# Altium schematic sheet BSR049A.SchDoc: LM5146 BUCK SCHEMATIC DIAGRAM
size 431 x 279 mm; Date: Not shown in title block; ApprovedBy: Not shown in title block; CheckedBy: Not shown in title block; Author: Not shown in title block; CompanyName: Not shown in title block; DrawnBy: K Nielson; Engineer: Not shown in title block; Organization: Not shown in title block; Address1: Not shown in title block; Address2: Not shown in title block; Address3: Not shown in title block; Address4: Not shown in title block; DocumentNumber: 1; Revision: Use project parameter SCH_Rev; SheetNumber: 1; SheetTotal: 2; PageSetup: Record=PageOptions|CenterHorizontal=True|CenterVertical=True|PrintScale=0.96|XCorrection=1.00|YCorrection=1.00|PrintKind=0|BorderSize=5000000|LeftOffset=0|BottomOffset=0|Orientation=2|PaperLength=1000|PaperWidth=1000|Scale=100|PaperSource=15|PrintQuality=-3|MediaType=1|DitherType=10|PrintScaleMode=1|PaperKind=11x17|PaperIndex=17; CurrentTime: Not shown in title block; CurrentDate: Not shown in title block; Time: Not shown in title block; DocumentFullPathAndName: Not shown in title block; DocumentName: Not shown in title block; ModifiedDate: Not shown in title block; ImagePath: Not shown in title block
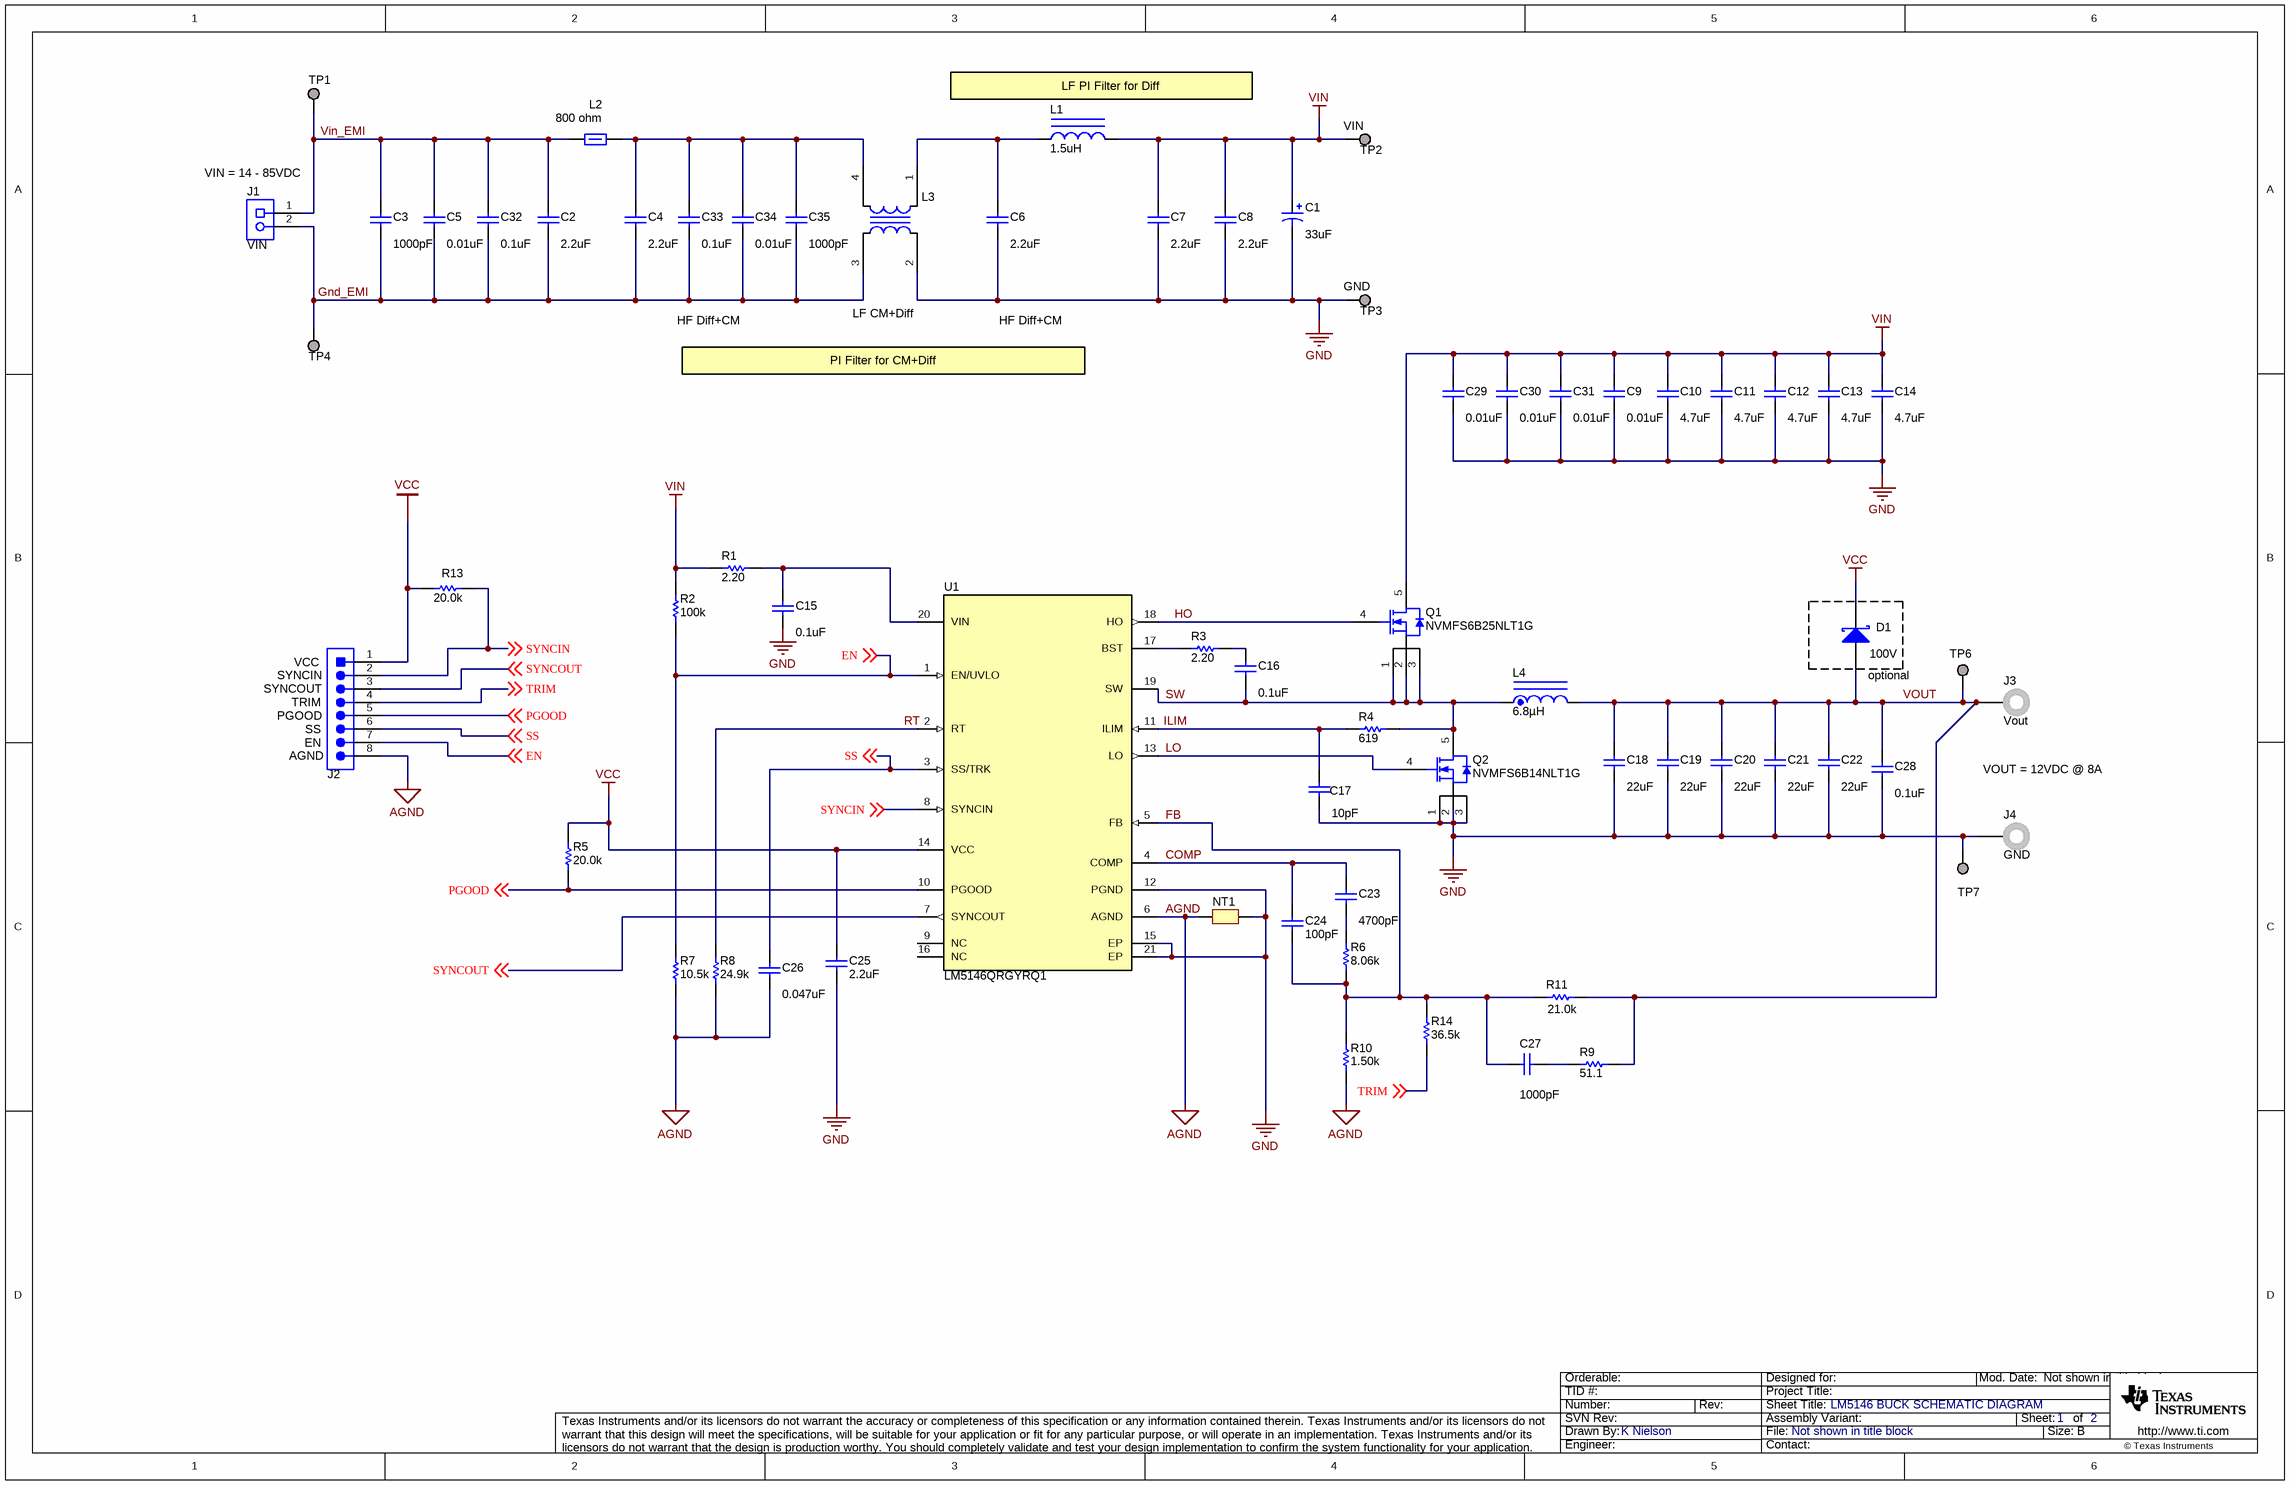
[diagram p0: BSR049A.SchDoc]

## Parts
C1  ValueDisplayed: 33uF  [SM_RADIAL_G]  (hidden comment: EEE-FK2A330P)
C2  ValueDisplayed: 2.2uF  [1210_250]  (hidden comment: CGA6N3X7R2A225K230AB)
C3  ValueDisplayed: 1000pF  [0603L]  (hidden comment: CGA3E2X7R2A102K080AA)
C4  ValueDisplayed: 2.2uF  [1210_250]  (hidden comment: CGA6N3X7R2A225K230AB)
C5  ValueDisplayed: 0.01uF  [0603L]  (hidden comment: GRM188R72A103KA01D)
C6  ValueDisplayed: 2.2uF  [1210_250]  (hidden comment: CGA6N3X7R2A225K230AB)
C7  ValueDisplayed: 2.2uF  [1210_250]  (hidden comment: CGA6N3X7R2A225K230AB)
C8  ValueDisplayed: 2.2uF  [1210_250]  (hidden comment: CGA6N3X7R2A225K230AB)
C9  ValueDisplayed: 0.01uF  [0603L]  (hidden comment: GRM188R72A103KA01D)
C10  ValueDisplayed: 4.7uF  [1210]  (hidden comment: C3225X7S2A475K200AE)
C11  ValueDisplayed: 4.7uF  [1210]  (hidden comment: C3225X7S2A475K200AE)
C12  ValueDisplayed: 4.7uF  [1210]  (hidden comment: C3225X7S2A475K200AE)
C13  ValueDisplayed: 4.7uF  [1210]  (hidden comment: C3225X7S2A475K200AE)
C14  ValueDisplayed: 4.7uF  [1210]  (hidden comment: C3225X7S2A475K200AE)
C15  ValueDisplayed: 0.1uF  [0603L]  (hidden comment: CGA3E3X7S2A104K080AB)
C16  ValueDisplayed: 0.1uF  [0603L]  (hidden comment: CGA3E3X7S2A104K080AB)
C17  ValueDisplayed: 10pF  [0603L]  (hidden comment: 885012006073)
C18  ValueDisplayed: 22uF  [1210_270]  (hidden comment: TMK325B7226KMHT)
C19  ValueDisplayed: 22uF  [1210_270]  (hidden comment: TMK325B7226KMHT)
C20  ValueDisplayed: 22uF  [1210_270]  (hidden comment: TMK325B7226KMHT)
C21  ValueDisplayed: 22uF  [1210_270]  (hidden comment: TMK325B7226KMHT)
C22  ValueDisplayed: 22uF  [1210_270]  (hidden comment: TMK325B7226KMHT)
C23  ValueDisplayed: 4700pF  [0402]  (hidden comment: GRM155R71C472KA01D)
C24  ValueDisplayed: 100pF  [0402]  (hidden comment: CGA2B2C0G1H101J050BA)
C25  ValueDisplayed: 2.2uF  [0805_HV]  (hidden comment: GRM21BR71E225KA73L)
C26  ValueDisplayed: 0.047uF  [0402]  (hidden comment: C1005X7R1C473K050BC)
C27  ValueDisplayed: 1000pF  [0402]  (hidden comment: CGA2B2X7R1H102K050BA)
C28  ValueDisplayed: 0.1uF  [0603L]  (hidden comment: CGA3E3X7S2A104K080AB)
C29  ValueDisplayed: 0.01uF  [0603L]  (hidden comment: GRM188R72A103KA01D)
C30  ValueDisplayed: 0.01uF  [0603L]  (hidden comment: GRM188R72A103KA01D)
C31  ValueDisplayed: 0.01uF  [0603L]  (hidden comment: GRM188R72A103KA01D)
C32  ValueDisplayed: 0.1uF  [0603L]  (hidden comment: CGA3E3X7S2A104K080AB)
C33  ValueDisplayed: 0.1uF  [0603L]  (hidden comment: CGA3E3X7S2A104K080AB)
C34  ValueDisplayed: 0.01uF  [0603L]  (hidden comment: GRM188R72A103KA01D)
C35  ValueDisplayed: 1000pF  [0603L]  (hidden comment: CGA3E2X7R2A102K080AA)
D1  100V  [SOD-523]
J1  VIN  [Phoenix_1984617]
J2  TSW-108-07-G-S  [TSW-108-07-G-S]  (value not drawn)
J3  Vout  [Keystone575-8]
J4  GND  [Keystone575-8]
L1  ValueDisplayed: 1.5uH  [VCMT063T]  (hidden comment: VCMT063T-1R5MN5)
L2  800 ohm  [2220_390]
L3  ACM12V-701-2PL-TL00  [TDK_ACM12V]  (value not drawn)
L4  ValueDisplayed: 6.8µH  [VCHA105D]  (hidden comment: VCHA105D-6R8MS6)
NT1  net tie  [Net-Tie_10mil]  (value not drawn)  (net tie, no BOM)
Q1  NVMFS6B25NLT1G  [SO-8FL]
Q2  NVMFS6B14NLT1G  [SO-8FL]
R1  ValueDisplayed: 2.20  [0603L]  (hidden comment: ERJ-3RQF2R2V)
R2  ValueDisplayed: 100k  [0603]  (hidden comment: CRCW0603100KFKEA)
R3  ValueDisplayed: 2.20  [0603L]  (hidden comment: ERJ-3RQF2R2V)
R4  ValueDisplayed: 619  [0402]  (hidden comment: CRCW0402619RFKED)
R5  ValueDisplayed: 20.0k  [0402]  (hidden comment: CRCW040220K0FKED)
R6  ValueDisplayed: 8.06k  [0402]  (hidden comment: CRCW04028K06FKED)
R7  ValueDisplayed: 10.5k  [0402]  (hidden comment: CRCW040210K5FKED)
R8  ValueDisplayed: 24.9k  [0402]  (hidden comment: CRCW040224K9FKED)
R9  ValueDisplayed: 51.1  [0402]  (hidden comment: CRCW040251R1FKED)
R10  ValueDisplayed: 1.50k  [0402]  (hidden comment: CRCW04021K50FKED)
R11  ValueDisplayed: 21.0k  [0402]  (hidden comment: CRCW040221K0FKED)
R13  ValueDisplayed: 20.0k  [0603L]  (hidden comment: CRCW060320K0FKEA)
R14  ValueDisplayed: 36.5k  [0402]  (hidden comment: CRCW040236K5FKED)
TP1  5017  [Keystone_5017]  (value not drawn)
TP2  VIN  [Keystone_5017]
TP3  GND  [Keystone_5017]
TP4  GND  [Keystone_5017]  (value not drawn)
TP6  GND  [Keystone_5017]  (value not drawn)
TP7  GND  [Keystone_5017]  (value not drawn)
U1  LM5146QRGYRQ1  [RGY0020B]

## Nets
AGND: C26.1 J2.8 NT1.1 R7.1 R8.2 R10.1 U1.6(AGND)
GND: C1.2(-) C6.2 C7.2 C8.2 C9.2 C10.2 C11.2 C12.2 C13.2 C14.2 C15.2 C17.2 C18.2 C19.2 C20.2 C21.2 C22.2 C25.2 C28.2 C29.2 C30.2 C31.2 J4.1 L3.2 NT1.2 Q2.1(S) Q2.2(S) Q2.3(S) TP3.1 TP7.1 U1.12(PGND) U1.15(EP) U1.21(EP)
VCC: C25.1 D1.1(K) J2.1 R5.1 R13.1 U1.14(VCC)
VIN: C1.1(+) C7.1 C8.1 C9.1 C10.1 C11.1 C12.1 C13.1 C14.1 C29.1 C30.1 C31.1 L1.2 Q1.5(D) R1.1 R2.1 TP2.1
COMP: C23.1 C24.1 U1.4(COMP)
EN: J2.7 R2.2 R7.2 U1.1(EN/UVLO) ; off-sheet EN
FB: C24.2 C27.2 R6.1 R10.2 R11.2 R14.2 U1.5(FB)
Gnd_EMI: C2.2 C3.2 C4.2 C5.2 C32.2 C33.2 C34.2 C35.2 J1.2 L3.3 TP4.1
HO: Q1.4(G) U1.18(HO)
ILIM: C17.1 R4.1 U1.11(ILIM)
LO: Q2.4(G) U1.13(LO)
PGOOD: J2.5 R5.2 U1.10(PGOOD) ; off-sheet PGOOD
RT: R8.1 U1.2(RT)
SS: C26.2 J2.6 U1.3(SS/TRK) ; off-sheet SS
SW: C16.2 L4.1 Q1.1(S) Q1.2(S) Q1.3(S) Q2.5(D) R4.2 U1.19(SW)
SYNCIN: J2.2 R13.2 U1.8(SYNCIN) ; off-sheet SYNCIN
SYNCOUT: J2.3 U1.7(SYNCOUT) ; off-sheet SYNCOUT
TRIM: J2.4 R14.1 ; off-sheet TRIM
Vin_EMI: C2.1 C3.1 C5.1 C32.1 J1.1 L2.1 TP1.1
VOUT: C18.1 C19.1 C20.1 C21.1 C22.1 C28.1 D1.2(A) J3.1 L4.2 R9.1 R11.1 TP6.1
NetC4_1: C4.1 C33.1 C34.1 C35.1 L2.2 L3.4
NetC6_1: C6.1 L1.1 L3.1
NetC15_1: C15.1 R1.2 U1.20(VIN)
NetC16_1: C16.1 R3.2
NetC23_2: C23.2 R6.2
NetC27_1: C27.1 R9.2
NetR3_1: R3.1 U1.17(BST)

Not connected (* = marked no-connect by the designer): U1 9(NC) 16(NC)

## Notes on the sheet
- (near L1) LF PI Filter for Diff
- (near J1) VIN = 14 - 85VDC
- HF Diff+CM
- LF CM+Diff
- PI Filter for CM+Diff
- (near J2) SYNCOUT
- (near J2) SYNCIN
- (near J2) VCC
- (near J2) TRIM
- (near D1) optional
- (near J2) PGOOD
- (near J2) AGND
- (near J2) SS
- (near J2) EN
- VOUT = 12VDC @ 8A
- Drawn By:
- SVN Rev:
- Number:
- TID #:
- Orderable:
- Rev:
- Sheet Title:
- File:
- Project Title:
- Designed for:
- Assembly Variant:
- Mod. Date:
- Sheet:
- Size:
- of
- B
- http://www.ti.com
- Texas Instruments and/or its licensors do not warrant the accuracy or completeness of this specification or any information contained therein. Texas Instruments and/or its licensors do not warrant that this design will meet the specifications, will be suitable for your application or fit for any particular purpose, or will operate in an implementation. Texas Instruments and/or its licensors do not warrant that the design is production worthy. You should completely validate and test your design implementation to confirm the system functionality for your application.
- Engineer:
- Contact:
- © Texas Instruments

## Library data of the parts
C1 = CMP-0011203-2: CAP, AL, 33 uF, 100 V, +/- 20%, 0.7 ohm, AEC-Q200 Grade 2, SMD; Manufacturer: Panasonic; Cap_F: 33µF; IRMS_A: 2dA; SizeAreaWB_mm2: 172.2; SizeArea_mm2: 123.6; AEC Qualified: Y; AEC Category: Q200; Value: 33uF; TaMax_C: 105°C; SizeZ_mm: 10.2; AEC Grade: 2; TaMin_C: -55°C; VDC_V: 100V; SizeY_mm: 10.3; U/M: EA; Value1: 0.7 ohm; CompType: Capacitor; SizeX_mm: 12; ESR_ohm: 7d; Cap_Case: G; ComponentLink1Description: Datasheet link; RoHS: Y; Supplier Part Number 3: 1850130; Tolerance_%: 20%; Supplier 1: Digi-Key; Series: FK; PackageReference: SMT Radial G; Technology: AL; PartNumber: EEE-FK2A330P; Supplier Part Number 2: 667-EEE-FK2A330P; Supplier 2: Mouser; Polarized: Y; Value2: 100V; ComponentLink1URL: https://industrial.panasonic.com/cdbs/www-data/pdf/RDE0000/ABA0000C1181.pdf; MountType: SMT; Supplier Part Number 1: PCE3846CT-ND; Supplier 3: Farnell; LatestRevisionDate: 2017-03-09; Publisher: Texas Instruments
C2 C4 = CMP-0009152-2: CAP, CERM, 2.2 uF, 100 V, +/- 10%, X7R, AEC-Q200 Grade 1,; Manufacturer: TDK; TaMin_C: -55°C; Polarized: N; SizeAreaWB_mm2: 14.7; Value1: 0.00173 ohm; U/M: EA; Value: 2.2uF; TaMax_C: 125°C; SizeZ_mm: 2.5; SizeX_mm: 3.2; Value2: 100V; SizeArea_mm2: 8; CompType: Capacitor; AEC Qualified: Y; Cap_F: 2.2µF; AEC Grade: 1; AEC Category: Q200; ESR_ohm: 1.73m; IRMS_A: 5.59317A; Supplier Part Number 2: 810-CGA6N3X7R2A225K230AB; Publisher: Texas Instruments; Supplier 2: Mouser; TempCo: X7R; Published: 2008-06-19; RoHS: Y; MountType: SMT; Supplier 1: Digi-Key; Tolerance_%: 10%; SizeY_mm: 2.5; Cap_Case: 1210_250; LatestRevisionDate: 2017-03-09; PartNumber: CGA6N3X7R2A225K230AB; VDC_V: 100V; ComponentLink1Description: Datasheet link; Supplier Part Number 1: 445-5866-1-ND; Technology: Ceramic; ComponentLink1URL: https://product.tdk.com/en/search/capacitor/ceramic/mlcc/info?part_no=CGA6N3X7R2A225K230AB
C3 C35 = CMP-0007081-4: CAP, CERM, 1000 pF, 100 V, +/- 10%, X7R, AEC-Q200 Grade 1, 0603; Manufacturer: TDK; TaMin_C: -55°C; ESR_ohm: 1.97137; Polarized: N; SizeAreaWB_mm2: 4.68; Value1: 1.97137 ohm; U/M: EA; Value: 1000pF; TaMax_C: 125°C; SizeZ_mm: 1; SizeX_mm: 1.6; SizeY_mm: 0.8; Cap_Case: 0603; Value2: 100V; SizeArea_mm2: 1.28; CompType: Capacitor; AEC Qualified: Y; Cap_F: 1nF; IRMS_A: 3.05705dA; AEC Category: Q200; Supplier Part Number 2: 810-CGA3E2X7R2A102K080AA; Publisher: Texas Instruments; Supplier 2: Mouser; TempCo: X7R; Published: 2008-06-19; RoHS: Y; MountType: SMT; Supplier 1: Digi-Key; PackageReference: 0603; Tolerance_%: 10%; LatestRevisionDate: 2017-03-09; PartNumber: CGA3E2X7R2A102K080AA; VDC_V: 100V; ComponentLink1Description: Datasheet link; AEC Grade: 1; Supplier Part Number 1: 445-5806-1-ND; Technology: Ceramic; ComponentLink1URL: https://product.tdk.com/en/search/capacitor/ceramic/mlcc/info?part_no=CGA3E2X7R2A102K080AA
C5 C29-C31 C34 = CMP-0007468-5: CAP, CERM, 0.01 uF, 100 V, +/- 10%, X7R, 0603; Manufacturer: MuRata; TaMin_C: -55°C; Polarized: N; SizeAreaWB_mm2: 4.68; Value1: Unknown; U/M: EA; Value: 0.01uF; TaMax_C: 125°C; SizeZ_mm: 1; SizeX_mm: 1.6; SizeY_mm: 0.8; Cap_Case: 0603; Value2: 100V; SizeArea_mm2: 1.28; CompType: Capacitor; Cap_F: 10nF; AEC Category: Q200; Supplier Part Number 2: 81-GRM188R72A103KA1D; Publisher: Texas Instruments; Supplier 2: Mouser; TempCo: X7R; Published: 2008-06-19; RoHS: Y; MountType: SMT; Supplier 1: Digi-Key; PackageReference: 0603; Tolerance_%: 10%; LatestRevisionDate: 2017-03-09; PartNumber: GRM188R72A103KA01D; AEC Qualified: ?; VDC_V: 100V; ComponentLink1Description: Datasheet link; Supplier Part Number 1: GRM188R72A103KA01D-ND; Technology: Ceramic; ComponentLink1URL: http://search.murata.co.jp/Ceramy/PnsearchViewAction.do?HnOFG=ON&HnNFG=ON&SEL_CNT=50&sLang=en&sKey=GRM188R72A103KA01D&x=9&y=9&search=startwith
C6-C8 = CMP-0009152-2: CAP, CERM, 2.2 uF, 100 V, +/- 10%, X7R, AEC-Q200 Grade 1,; Manufacturer: TDK; TaMin_C: -55°C; Polarized: N; SizeAreaWB_mm2: 14.7; Value1: 0.00173 ohm; U/M: EA; Value: 2.2uF; TaMax_C: 125°C; SizeZ_mm: 2.5; SizeX_mm: 3.2; Value2: 100V; SizeArea_mm2: 8; AEC Qualified: Y; Cap_F: 2.2µF; AEC Grade: 1; AEC Category: Q200; ESR_ohm: 1.73m; IRMS_A: 5.59317A; Supplier Part Number 2: 810-CGA6N3X7R2A225K230AB; Publisher: Texas Instruments; Supplier 2: Mouser; TempCo: X7R; Published: 2008-06-19; RoHS: Y; MountType: SMT; Supplier 1: Digi-Key; Tolerance_%: 10%; SizeY_mm: 2.5; Cap_Case: 1210_250; CompType: Capacitor; LatestRevisionDate: 2017-03-09; PartNumber: CGA6N3X7R2A225K230AB; VDC_V: 100V; ComponentLink1Description: Datasheet link; Supplier Part Number 1: 445-5866-1-ND; Technology: Ceramic; ComponentLink1URL: https://product.tdk.com/en/search/capacitor/ceramic/mlcc/info?part_no=CGA6N3X7R2A225K230AB
C9 = CMP-0007468-5: CAP, CERM, 0.01 uF, 100 V, +/- 10%, X7R, 0603; Manufacturer: MuRata; TaMin_C: -55°C; Polarized: N; SizeAreaWB_mm2: 4.68; Value1: Unknown; U/M: EA; Value: 0.01uF; TaMax_C: 125°C; SizeZ_mm: 1; SizeX_mm: 1.6; SizeY_mm: 0.8; Cap_Case: 0603; Value2: 100V; SizeArea_mm2: 1.28; Cap_F: 10nF; AEC Category: Q200; Supplier Part Number 2: 81-GRM188R72A103KA1D; Publisher: Texas Instruments; Supplier 2: Mouser; TempCo: X7R; Published: 2008-06-19; RoHS: Y; MountType: SMT; Supplier 1: Digi-Key; PackageReference: 0603; Tolerance_%: 10%; CompType: Capacitor; LatestRevisionDate: 2017-03-09; PartNumber: GRM188R72A103KA01D; AEC Qualified: ?; VDC_V: 100V; ComponentLink1Description: Datasheet link; Supplier Part Number 1: GRM188R72A103KA01D-ND; Technology: Ceramic; ComponentLink1URL: http://search.murata.co.jp/Ceramy/PnsearchViewAction.do?HnOFG=ON&HnNFG=ON&SEL_CNT=50&sLang=en&sKey=GRM188R72A103KA01D&x=9&y=9&search=startwith
C10 C12-C14 = CMP-0009135-2: CAP, CERM, 4.7 uF, 100 V, +/- 10%, X7S, 1210; Manufacturer: TDK; TaMin_C: -55°C; Polarized: N; SizeAreaWB_mm2: 14.7; Value1: Unknown; U/M: EA; Value: 4.7uF; TaMax_C: 125°C; SizeZ_mm: 1.35; SizeX_mm: 3.2; SizeY_mm: 2.5; Value2: 100V; SizeArea_mm2: 8; CompType: Capacitor; Cap_F: 4.7µF; AEC Category: Q200; Supplier Part Number 2: 93T4954; Publisher: Texas Instruments; Supplier 2: Newark; Supplier Part Number 3: 810-C3225X7S2A475KST; TempCo: X7S; Supplier 3: Mouser; Published: 2008-06-19; RoHS: Y; MountType: SMT; Supplier 1: Digi-Key; PackageReference: 1210; Tolerance_%: 10%; Cap_Case: 1210; LatestRevisionDate: 2017-03-09; PartNumber: C3225X7S2A475K200AE; AEC Qualified: N; VDC_V: 100V; ComponentLink1Description: Datasheet link; AEC Grade: N/A; Supplier Part Number 1: 445-8912-1-ND; Technology: Ceramic; ComponentLink1URL: https://product.tdk.com/info/en/catalog/datasheets/mlcc_commercial_midvoltage_en.pdf
C11 = CMP-0009135-2: CAP, CERM, 4.7 uF, 100 V, +/- 10%, X7S, 1210; Manufacturer: TDK; TaMin_C: -55°C; Polarized: N; SizeAreaWB_mm2: 14.7; Value1: Unknown; U/M: EA; Value: 4.7uF; TaMax_C: 125°C; SizeZ_mm: 1.35; SizeX_mm: 3.2; SizeY_mm: 2.5; Value2: 100V; SizeArea_mm2: 8; Cap_F: 4.7µF; AEC Category: Q200; Supplier Part Number 2: 93T4954; Publisher: Texas Instruments; Supplier 2: Newark; Supplier Part Number 3: 810-C3225X7S2A475KST; TempCo: X7S; Supplier 3: Mouser; Published: 2008-06-19; RoHS: Y; MountType: SMT; Supplier 1: Digi-Key; PackageReference: 1210; Tolerance_%: 10%; Cap_Case: 1210; CompType: Capacitor; LatestRevisionDate: 2017-03-09; PartNumber: C3225X7S2A475K200AE; AEC Qualified: N; VDC_V: 100V; ComponentLink1Description: Datasheet link; AEC Grade: N/A; Supplier Part Number 1: 445-8912-1-ND; Technology: Ceramic; ComponentLink1URL: https://product.tdk.com/info/en/catalog/datasheets/mlcc_commercial_midvoltage_en.pdf
C15 C16 C28 C32 C33 = CMP-0007099-4: CAP, CERM, 0.1 uF, 100 V, +/- 10%, X7S, AEC-Q200 Grade 1, 0603; Manufacturer: TDK; TaMin_C: -55°C; ESR_ohm: 0.04959; Polarized: N; SizeAreaWB_mm2: 4.68; Value1: 0.04959 ohm; U/M: EA; Value: 0.1uF; TaMax_C: 125°C; SizeZ_mm: 1; SizeX_mm: 1.6; SizeY_mm: 0.8; Cap_Case: 0603; Value2: 100V; SizeArea_mm2: 1.28; CompType: Capacitor; AEC Qualified: Y; Cap_F: 100nF; IRMS_A: 7.51618dA; AEC Category: Q200; Supplier Part Number 2: 04X3163; Supplier 2: Newark; TempCo: X7S; RoHS: Y; MountType: SMT; Supplier 1: Digi-Key; PackageReference: 0603; Tolerance_%: 10%; PartNumber: CGA3E3X7S2A104K080AB; VDC_V: 100V; ComponentLink1Description: Datasheet link; AEC Grade: 1; Supplier Part Number 1: 445-6938-1-ND; Technology: Ceramic; ComponentLink1URL: https://product.tdk.com/en/search/capacitor/ceramic/mlcc/info?part_no=CGA3E3X7S2A104K080AB; Supplier 3: Mouser; Supplier Part Number 3: 810-CGA3E3X7S2A104K; Publisher: Texas Instruments; Published: 2008-06-19; LatestRevisionDate: 2017-03-09
C17 = CMP-0078152-1: CAP, CERM, 10 pF, 100 V,+/- 5%, C0G/NP0, 0603; Manufacturer: Wurth Elektronik; TaMin_C: -55°C; Polarized: N; SizeAreaWB_mm2: 4.68; U/M: EA; Value: 10pF; TaMax_C: 125°C; SizeZ_mm: 1; SizeX_mm: 1.6; SizeY_mm: 0.8; Cap_Case: 0603; Value2: 100V; SizeArea_mm2: 1.28; CompType: Capacitor; AEC Category: Q200; TempCo: C0G/NP0; RoHS: Y; MountType: SMT; PackageReference: 0603; Tolerance_%: 5%; PartNumber: 885012006073; AEC Qualified: N; Cap_F: 10pF; VDC_V: 100V; ComponentLink1Description: Datasheet link; AEC Grade: N/A; Technology: Ceramic; ComponentLink1URL: http://katalog.we-online.com/pbs/datasheet/885012006073.pdf; Publisher: Texas Instruments; Published: 2008-06-19; LatestRevisionDate: 2017-10-09
C18 = CMP-0009255-2: CAP, CERM, 22 uF, 25 V, +/- 10%, X7R, AEC-Q200 Grade 1, 1210; Manufacturer: Taiyo Yuden; TaMin_C: -55°C; Polarized: N; SizeAreaWB_mm2: 14.7; Value1: Unknown; U/M: EA; Value: 22uF; TaMax_C: 125°C; SizeZ_mm: 2.7; SizeX_mm: 3.2; SizeY_mm: 2.5; Cap_Case: 1210; Value2: 25V; SizeArea_mm2: 8; CompType: Capacitor; AEC Qualified: Y; Cap_F: 22µF; AEC Grade: 1; AEC Category: Q200; Supplier Part Number 2: 963-TMK325B7226KMHT; Supplier 2: Mouser; TempCo: X7R; RoHS: Y; MountType: SMT; Supplier 1: Digi-Key; PackageReference: 1210; Tolerance_%: 10%; PartNumber: TMK325B7226KMHT; VDC_V: 25V; ComponentLink1Description: Datasheet link; Supplier Part Number 1: 587-4337-1-ND; Technology: Ceramic; ComponentLink1URL: http://www.yuden.co.jp/productdata/catalog/en/mlcc_all_hq_e.pdf; Publisher: Texas Instruments; Published: 2008-06-19; LatestRevisionDate: 2017-03-09
C19-C22 = CMP-0009255-2: CAP, CERM, 22 uF, 25 V, +/- 10%, X7R, AEC-Q200 Grade 1, 1210; Manufacturer: Taiyo Yuden; TaMin_C: -55°C; Polarized: N; SizeAreaWB_mm2: 14.7; Value1: Unknown; U/M: EA; Value: 22uF; TaMax_C: 125°C; SizeZ_mm: 2.7; SizeX_mm: 3.2; SizeY_mm: 2.5; Cap_Case: 1210; Value2: 25V; SizeArea_mm2: 8; AEC Qualified: Y; Cap_F: 22µF; AEC Grade: 1; AEC Category: Q200; Supplier Part Number 2: 963-TMK325B7226KMHT; Supplier 2: Mouser; TempCo: X7R; RoHS: Y; MountType: SMT; Supplier 1: Digi-Key; PackageReference: 1210; Tolerance_%: 10%; CompType: Capacitor; PartNumber: TMK325B7226KMHT; VDC_V: 25V; ComponentLink1Description: Datasheet link; Supplier Part Number 1: 587-4337-1-ND; Technology: Ceramic; ComponentLink1URL: http://www.yuden.co.jp/productdata/catalog/en/mlcc_all_hq_e.pdf; Publisher: Texas Instruments; Published: 2008-06-19; LatestRevisionDate: 2017-03-09
C23 = CMP-0006652-2: CAP, CERM, 4700 pF, 16 V, +/- 10%, X7R, 0402; Manufacturer: MuRata; TaMin_C: -55°C; Polarized: N; SizeAreaWB_mm2: 3; Value1: Unknown; U/M: EA; Value: 4700pF; TaMax_C: 125°C; SizeZ_mm: 0.6; SizeX_mm: 1; SizeY_mm: 0.5; Value2: 16V; Cap_F: 4.7nF; AEC Category: Q200; Supplier Part Number 2: 81-GRM155R71C472KA1D; Publisher: Texas Instruments; Supplier 2: Mouser; TempCo: X7R; Published: 2008-06-19; RoHS: Y; MountType: SMT; Supplier 1: Digi-Key; PackageReference: 0402; Tolerance_%: 10%; Cap_Case: 0402; SizeArea_mm2: 0.5; CompType: Capacitor; LatestRevisionDate: 2017-03-09; PartNumber: GRM155R71C472KA01D; AEC Qualified: ?; VDC_V: 16V; ComponentLink1Description: Datasheet link; Supplier Part Number 1: GRM155R71C472KA01D-ND; Technology: Ceramic; ComponentLink1URL: http://search.murata.co.jp/Ceramy/PnsearchViewAction.do?HnOFG=ON&HnNFG=ON&SEL_CNT=50&sLang=en&sKey=GRM155R71C472KA01D&x=9&y=9&search=startwith
C24 = CMP-0006308-2: CAP, CERM, 100 pF, 50 V, +/- 5%, C0G/NP0, AEC-Q200 Grade 1, 0402; Manufacturer: TDK; Polarized: N; Value: 100pF; U/M: EA; Value1: Unknown; VDC_V: 50V; TaMin_C: -55°C; TaMax_C: 125°C; SizeArea_mm2: 0.5; SizeAreaWB_mm2: 3; SizeX_mm: 1; SizeZ_mm: 0.6; AEC Category: Q200; AEC Qualified: Y; CompType: Capacitor; PartNumber: CGA2B2C0G1H101J050BA; PackageReference: 0402; RoHS: Y; Cap_F: 100pF; Tolerance_%: 5%; Value2: 50V; MountType: SMT; Technology: Ceramic; TempCo: C0G/NP0; Cap_Case: 0402; Published: 2008-06-19; Publisher: Texas Instruments; LatestRevisionDate: 2017-03-09; ComponentLink1Description: Datasheet link; ComponentLink1URL: http://product.tdk.com/en/catalog/datasheets/mlcc_automotive_general_en.pdf; Supplier 1: Digi-Key; Supplier Part Number 1: 445-5596-1-ND; Supplier 2: Newark; Supplier Part Number 2: 52W9564; Supplier 3: Mouser; Supplier Part Number 3: 810-CGA2B2C0G1H101J; SizeY_mm: 0.5; AEC Grade: 1
C25 = CMP-0008342-2: CAP, CERM, 2.2 uF, 25 V, +/- 10%, X7R, 0805; Manufacturer: MuRata; Polarized: N; CompType: Capacitor; Value: 2.2uF; U/M: EA; Cap_F: 2.2µF; ESR_ohm: 5m; Value1: 0.005 ohm; VDC_V: 25V; TaMin_C: -55°C; TaMax_C: 125°C; Cap_Case: 0805; SizeArea_mm2: 2.5; SizeAreaWB_mm2: 6.75; SizeX_mm: 2; SizeY_mm: 1.25; SizeZ_mm: 1.45; AEC Category: Q200; PartNumber: GRM21BR71E225KA73L; PackageReference: 0805; RoHS: Y; Tolerance_%: 10%; Value2: 25V; MountType: SMT; Technology: Ceramic; TempCo: X7R; Published: 2008-06-19; Publisher: Texas Instruments; LatestRevisionDate: 2017-03-09; ComponentLink1Description: Datasheet link; ComponentLink1URL: http://search.murata.co.jp/Ceramy/PnsearchViewAction.do?HnOFG=ON&HnNFG=ON&SEL_CNT=50&sLang=en&sKey=GRM21BR71E225KA73L&x=9&y=9&search=startwith; Supplier 1: Digi-Key; Supplier Part Number 1: 490-3331-1-ND; Supplier 2: Mouser; Supplier Part Number 2: 81-GRM21BR71E225KA73; Supplier 3: Farnell; Supplier Part Number 3: 1735542; AEC Qualified: ?
C26 = CMP-0006294-2: CAP, CERM, 0.047 uF, 16 V, +/- 10%, X7R, 0402; Manufacturer: TDK; Value1: 0.0305 ohm; SizeZ_mm: 0.6; SizeX_mm: 1; SizeY_mm: 0.5; Value2: 16V; AEC Qualified: N; AEC Category: Q200; TaMin_C: -55°C; ESR_ohm: 0.0305; SizeAreaWB_mm2: 3; U/M: EA; TaMax_C: 125°C; Cap_F: 47nF; Supplier Part Number 2: 90R7602; Supplier 2: Newark; TempCo: X7R; RoHS: Y; MountType: SMT; Value: 0.047uF; Supplier 1: Digi-Key; PackageReference: 0402; Tolerance_%: 10%; SizeArea_mm2: 0.5; CompType: Capacitor; PartNumber: C1005X7R1C473K050BC; VDC_V: 16V; ComponentLink1Description: Datasheet link; AEC Grade: N/A; Supplier Part Number 1: 445-1264-1-ND; Technology: Ceramic; ComponentLink1URL: http://www.tdk.co.jp/tefe02/e412_c.pdf; Supplier 3: Mouser; Supplier Part Number 3: 810-C1005X7R1C473K; Publisher: Texas Instruments; Polarized: N; Published: 2008-06-19; Cap_Case: 0402; LatestRevisionDate: 2017-03-09
C27 = CMP-0006314-2: CAP, CERM, 1000 pF, 50 V, +/- 10%, X7R, AEC-Q200 Grade 1, 0402; Manufacturer: TDK; Value: 1000pF; SizeZ_mm: 0.6; SizeX_mm: 1; SizeY_mm: 0.5; Value2: 50V; AEC Qualified: Y; AEC Category: Q200; Value1: 2.25564 ohm; TaMin_C: -55°C; Polarized: N; SizeAreaWB_mm2: 3; U/M: EA; TaMax_C: 125°C; Cap_F: 1nF; ESR_ohm: 2.25564; IRMS_A: 2.80466dA; ComponentLink1URL: https://product.tdk.com/en/search/capacitor/ceramic/mlcc/info?part_no=CGA2B2X7R1H102K050BA; Supplier Part Number 2: 810-CGA2B2X7R1H102K050BA; Supplier 2: Mouser; TempCo: X7R; RoHS: Y; MountType: SMT; Supplier 1: Digi-Key; PackageReference: 0402; Tolerance_%: 10%; SizeArea_mm2: 0.5; CompType: Capacitor; PartNumber: CGA2B2X7R1H102K050BA; VDC_V: 50V; ComponentLink1Description: Datasheet link; AEC Grade: 1; Supplier Part Number 1: 445-5605-1-ND; Technology: Ceramic; Publisher: Texas Instruments; Published: 2008-06-19; Cap_Case: 0402; LatestRevisionDate: 2017-03-09
D1 = CMP-0028894-2: Diode, Schottky, 100 V, 0.2 A, SOD-523; Manufacturer: STMicroelectronics; PartNumber: BAT41KFILM; Io_A: 2dA; Green_Lifecycle: Not Set; SizeAreaWB_mm2: 5.13; Green_REACh: Incomplete; TJmax_C: 150°C; U/M: EA; SizeZ_mm: 0.65; SizeX_mm: 1.7; SizeY_mm: 0.9; Vf_V: 1V; SizeArea_mm2: 1.53; Value1: 0.2A; AEC Qualified: N; AEC Category: Q101; ComponentLink1URL: http://www.st.com/content/ccc/resource/technical/document/datasheet/5b/cd/d8/0a/45/56/41/6c/CD00130227.pdf/files/CD00130227.pdf/jcr:content/translations/en.CD00130227.pdf; Supplier Part Number 2: 05X9518; Publisher: Texas Instruments; Supplier 2: Newark; Vr_V: 100V; Published: 2008-06-26; RoHS: Y; MountType: SMT; Green_EU RoHS-2: Incomplete; Value: 100V; Supplier 1: Digi-Key; Green_EU RoHS: Incomplete; PackageReference: SOD-523; Value2: 1V; CompType: Diode; Type: Schottky; LatestRevisionDate: 2017-05-08; ComponentLink1Description: Datasheet link; Supplier Part Number 1: 497-5556-1-ND; Supplier 3: Mouser; Supplier Part Number 3: 511-BAT41KFILM
J1 = CMP-0055519-1: Terminal Block, 3.5mm, 2x1, TH; Manufacturer: Phoenix Contact; PartNumber: 1984617; CNHeader: FALSE; Current_A: 17.5A; Gender: Female; Cert_CULUS: Y; Voltage_V: 200V; Row_Count: 1; Pitch_mm: 3.5; CT: TRUE; ComponentLink1URL: https://www.phoenixcontact.com/online/portal/us?uri=pxc-oc-itemdetail:pid=1984617&library=usen&pcck=P-11-01-05&tab=1; Supplier Part Number 2: 15X5023; Publisher: Texas Instruments; Supplier 2: Newark; Supplier Part Number 3: 651-1984617; Color: Green; Supplier 3: Mouser; RoHS: Y; MountType: TH; Supplier 1: Digi-Key; PackageReference: Terminal Block, 3.5mm, 2x1, TH; PinCount: 2; CompType: Terminal Block; LatestRevisionDate: 26/05/2017; Orientation: Vertical; ComponentLink1Description: Datasheet URL; Supplier Part Number 1: 277-1721-ND; Cert_UL: Y
J2 = CMP-0075419-1: Header, 100mil, 8x1, Gold, TH; Manufacturer: Samtec; Pitch_mm: 2.54; Cert_VDE: N; Gender: Male; Cert_CSA: Y; Voltage_V: 550V; Green_REACh: Passed; Current_A: 6.3A; CT: False; Green_Lifecycle: Active; Row_Count: 1; CNHeader: True; ComponentLink1Description: Datasheet URL; RoHS: Y; Supplier 1: Digi-Key; Cert_UL: Y; Orientation: Vertical; Green_EU RoHS: Passed; PackageReference: 8x1 Header; Color: Black; PartNumber: TSW-108-07-G-S; PinCount: 8; Publisher: Texas Instruments; ContactFinish: Gold; Cert_CULUS: N; Shrouded: N; ClassName: Header; ComponentLink1URL: http://samtec.com/ftppub/pdf/TSW_TH.PDF; LatestRevisionDate: 2017-07-12; CompType: Header; MountType: TH; Supplier Part Number 1: SAM1029-08-ND; Green_EU RoHS-2: Passed
J3 J4 = CMP-0055166-2: Standard Banana Jack, Uninsulated, 8.9mm; PartNumber: 575-8; Manufacturer: Keystone; Green_REACh: Passed; CT: TRUE; Green_Lifecycle: Active; CNHeader: FALSE; ComponentLink1Description: Datasheet URL; RoHS: Y; Supplier 1: Digi-Key; Green_EU RoHS: Passed; PackageReference: Keystone575-8; Publisher: Texas Instruments; ComponentLink1URL: http://www.keyelco.com/pdfs/M55p95.pdf; LatestRevisionDate: 26/05/2017; CompType: Banana Jack; MountType: TH; Supplier Part Number 1: 36-575-8-ND; Green_EU RoHS-2: Incomplete
L1 = CMP-0059934-1: Inductor, Drum Core, Powdered Iron, 1.5 uH, 9 A, 0.0125 ohm, AEC-Q200 Grade 0, SMD; Manufacturer: Cyntec; Isat: 9A @ 20% inductance drop; Irms: 10.5A @ 40C rise; SizeAreaWB_mm2: 76.97; DCR_ohm: 0.0125; Value: 1.5uH; Imax_A: 9A; SizeZ_mm: 3; SizeX_mm: 6.95; SizeY_mm: 6.6; SizeArea_mm2: 45.87; Ind_H: 1.5µH; AEC Qualified: Y; AEC Grade: 0; AEC Category: Q200; ComponentLink1URL: http://www.cyntec.com/upfile/products/download/VCMT063T.pdf; Publisher: Texas Instruments; Published: 2008-06-26; RoHS: Y; Value1: 0.0125 ohm; Material: Powdered Iron; MountType: SMT; PackageReference: 6.95x6.6x3.0mm; Value2: 9A; CompType: Inductor; LatestRevisionDate: 2017-06-02; PartNumber: VCMT063T-1R5MN5; ComponentLink1Description: Datasheet link; Technology: Drum Core
L2 = CMP-0003396-1: Ferrite Bead, 800 ohm @ 100 MHz, 8 A, 2220; Manufacturer: Laird-Signal Integrity Products; PartNumber: HR2220V801R-10; Ztyp@1GHz_Ohm: 75; ZTyp@100MHz_Ohm: 800; SizeAreaWB_mm2: 53.96; DCR_ohm: 0.01; Value1: 0.01 ohm; Imax_A: 8A; SizeZ_mm: 3.9; SizeX_mm: 5.6; SizeY_mm: 5.1; SizeArea_mm2: 28.56; ComponentLink1URL: https://assets.lairdtech.com/home/brandworld/files/HR2220V801R-10.pdf; Supplier Part Number 2: 875-HR2220V801R-10; Publisher: Texas Instruments; Supplier 2: Mouser; Supplier Part Number 3: 1697264; Supplier 3: Farnell; Published: 2014-04-30; RoHS: Y; MountType: SMT; Value: 800 ohm; Supplier 1: Digi-Key; PackageReference: 2220; Value2: 8A; CompType: Ferrite Bead; LatestRevisionDate: 2017-03-09; ComponentLink1Description: Datasheet link; Supplier Part Number 1: 240-2433-1-ND; ValueDisplayed: 800 ohm
L3 = CMP-0084691-1: Coupled inductor,  ohm, AEC-Q200 Grade 1, SMD; Manufacturer: TDK; SizeAreaWB_mm2: 182; SizeZ_mm: 6; SizeX_mm: 12; SizeY_mm: 11; SizeArea_mm2: 132; AEC Grade: 1; AEC Category: Q200; AEC Qualified: Y; RoHS: Y; MountType: SMT; PackageReference: 12x11mm; CompType: Coupled Inductor; PartNumber: ACM12V-701-2PL-TL00; ComponentLink1Description: Datasheet URL; ComponentLink1URL: https://product.tdk.com/info/en/catalog/datasheets/cmf_automotive_power_acm12v_en.pdf
L4 = CMP-0082255-1: Inductor, Drum Core, Powdered Iron, 6.8 µH, 10.8 A, 0.014 ohm, AEC-Q200 Grade 0, SMD; Manufacturer: Cyntec; Isat: 11.4A @ 30% inductance drop; Irms: 10.8A @ 40C rise; SizeAreaWB_mm2: 154.2; DCR_ohm: 0.014; Value: 6.8uH; Imax_A: 10.8A; SizeZ_mm: 5.4; SizeX_mm: 10.85; SizeY_mm: 10; SizeArea_mm2: 108.5; AEC Qualified: Y; AEC Grade: 0; AEC Category: Q200; ComponentLink1URL: https://sps16.itg.ti.com/sites/KMS/crossdivteams/altium/docs/ComponentDatasheets/CYNVC-175-018 (A3) VCHA105D MS6 Series_standard.pdf; RoHS: Y; Value1: 0.014 ohm; Material: Powdered Iron; MountType: SMT; PackageReference: 10.85x10mm; Value2: 10.8A; CompType: Inductor; Ind_H: 6.8µH; PartNumber: VCHA105D-6R8MS6; ComponentLink1Description: Datasheet link; Technology: Drum Core
NT1 = CMP-0078142-2: Single point connection between nets.; CompType: Net-Tie; MountType: SMT; Manufacturer: N/A; PackageReference: N/A; PartNumber: N/A; Library Reference: Net-Tie
Q1 = CMP-0082014-2: MOSFET, N-CH, 100 V, 8 A, AEC-Q101, SO-8FL; Manufacturer: ON Semiconductor; Alternate Manufacturer: None; ChType: N; QgTyp_nC: 6.4; SizeAreaWB_mm2: 58.2725; SizeArea_mm2: 31.6725; IdsMax_A: 8A; AEC Qualified: Y; VdsMax_V: 100V; Rdson45_ohm: 0.039; Vgs_V: 16V; AEC Category: Q101; Value: 100V; SizeZ_mm: 1.1; SizeY_mm: 5.15; Value2: 6.4 nC; Value1: 0.039 ohm; SizeX_mm: 6.15; ChMode: Enhancement; ComponentLink1Description: Datasheet link; RoHS: Y; Supplier 1: Digi-Key; PackageReference: SO-8FL; PartNumber: NVMFS6B25NLT1G; Supplier Part Number 2: 863-NVMFS6B25NLT1G; Supplier 2: Mouser; ComponentLink1URL: http://www.onsemi.com/pub/Collateral/NVMFS6B25NL-D.PDF; CompType: MOSFET; MountType: SMT; Supplier Part Number 1: NVMFS6B25NLT1G-ND
Q2 = CMP-0081522-2: MOSFET, N-CH, 100 V, 11 A, AEC-Q101, SO-8FL; Manufacturer: ON Semiconductor; Alternate Manufacturer: None; ChType: N; QgTyp_nC: 8; SizeAreaWB_mm2: 58.2725; SizeArea_mm2: 31.6725; IdsMax_A: 11A; AEC Qualified: Y; VdsMax_V: 100V; Rdson45_ohm: 0.019; Vgs_V: 16V; AEC Category: Q101; Value: 100V; SizeZ_mm: 1; SizeY_mm: 6.15; Value2: 8 nC; Value1: 0.019 ohm; SizeX_mm: 5.15; ChMode: Enhancement; ComponentLink1Description: Datasheet link; RoHS: Y; Supplier Part Number 3: 863-NVMFS6B14NLT1G; Supplier 1: Digi-Key; PackageReference: SO-8FL; PartNumber: NVMFS6B14NLT1G; Supplier Part Number 2: 95Y0313; Supplier 2: Newark; ComponentLink1URL: http://www.onsemi.com/pub/Collateral/NVMFS6B14NL-D.PDF; CompType: MOSFET; MountType: SMT; Supplier Part Number 1: NVMFS6B14NLT1GOSCT-ND; Supplier 3: Mouser
R1 R3 = CMP-0022711-2: RES, 2.20, 1%, 0.1 W, 0603; Manufacturer: Panasonic; Power_W: 100mW; TempCo: 200 ppm/C; Value_Code: 2R20; Value: 2.20; Res_ohm: 2.2; SizeX_mm: 1.6; SizeY_mm: 0.8; SizeZ_mm: 1; Value2: 0.1W; SizeArea_mm2: 1.28; CompType: Resistor; AEC Category: Q200; U/M: EA; RoHS: Y; Value1: 1%; MountType: SMT; Supplier 1: Digi-Key; PackageReference: 0603; Tolerance_%: 1%; PartNumber: ERJ-3RQF2R2V; AEC Qualified: ?; ComponentLink1Description: Datasheet link; Supplier Part Number 1: P2.2AJCT-ND; Technology: Thick Film; ComponentLink1URL: http://industrial.panasonic.com/www-data/pdf/AOA0000/AOA0000CE3.pdf; Supplier 2: Newark; Supplier 3: Mouser; Supplier Part Number 2: 15R1437; Supplier Part Number 3: 667-ERJ-3RQF2R2V; Publisher: Texas Instruments; Published: 2008-06-26; LatestRevisionDate: 2017-03-09
R2 = CMP-0021990-4: RES, 100 k, 1%, 0.1 W, AEC-Q200 Grade 0, 0603; Manufacturer: Vishay-Dale; Power_W: 100mW; TempCo: 100 ppm/C; Value: 100k; EIA_Code: E96; SizeX_mm: 1.6; SizeY_mm: 0.8; SizeZ_mm: 1; Value2: 0.1W; SizeArea_mm2: 1.28; AEC Qualified: Y; VDC_V: 75V; AEC Grade: 0; AEC Category: Q200; ComponentLink1URL: http://www.vishay.com/docs/20035/dcrcwe3.pdf; Value_Code: 100k; RoHS: E; Value1: 1%; MountType: SMT; Supplier 1: Digi-Key; PackageReference: 0603; Tolerance_%: 1%; Res_ohm: 100k; CompType: Resistor; PartNumber: CRCW0603100KFKEA; ComponentLink1Description: Datasheet link; Supplier Part Number 1: 541-100KHCT-ND; Technology: Thick Film; Supplier 2: Newark; Supplier 3: Mouser; Supplier Part Number 2: 42K3668; Supplier Part Number 3: 71-CRCW0603-100K-E3
R4 = CMP-0026489-2: RES, 619, 1%, 0.063 W, AEC-Q200 Grade 0, 0402; Manufacturer: Vishay-Dale; Power_W: 63mW; TempCo: 100 ppm/C; Value_Code: 619R; Value: 619; EIA_Code: E96; SizeX_mm: 1; SizeY_mm: 0.5; SizeZ_mm: 0.6; Value2: 0.063W; AEC Qualified: Y; AEC Grade: 0; AEC Category: Q200; VDC_V: 50V; RoHS: E; Value1: 1%; MountType: SMT; Supplier 1: Digi-Key; PackageReference: 0402; Tolerance_%: 1%; Res_ohm: 619; SizeArea_mm2: 0.5; CompType: Resistor; PartNumber: CRCW0402619RFKED; ComponentLink1Description: Datasheet link; Supplier Part Number 1: 541-619LCT-ND; Technology: Thick Film; ComponentLink1URL: http://www.vishay.com/docs/20035/dcrcwe3.pdf; Supplier 2: Newark; Supplier 3: Mouser; Supplier Part Number 2: 52K7201; Supplier Part Number 3: 71-CRCW0402-619-E3
R5 = CMP-0026162-2: RES, 20.0 k, 1%, 0.063 W, AEC-Q200 Grade 0, 0402; Manufacturer: Vishay-Dale; Power_W: 63mW; TempCo: 100 ppm/C; Value_Code: 20k0; Value: 20.0k; EIA_Code: E96; Res_ohm: 20k; SizeX_mm: 1; SizeY_mm: 0.5; SizeZ_mm: 0.6; Value2: 0.063W; AEC Qualified: Y; VDC_V: 50V; AEC Category: Q200; AEC Grade: 0; Supplier Part Number 2: 52K6817; Supplier 2: Newark; Supplier Part Number 3: 71-CRCW0402-20K-E3; Supplier 3: Mouser; RoHS: E; Value1: 1%; MountType: SMT; Supplier 1: Digi-Key; PackageReference: 0402; Tolerance_%: 1%; SizeArea_mm2: 0.5; CompType: Resistor; PartNumber: CRCW040220K0FKED; ComponentLink1Description: Datasheet link; Supplier Part Number 1: 541-20.0KLCT-ND; Technology: Thick Film; ComponentLink1URL: http://www.vishay.com/docs/20035/dcrcwe3.pdf
R6 = CMP-0026588-2: RES, 8.06 k, 1%, 0.063 W, AEC-Q200 Grade 0, 0402; Manufacturer: Vishay-Dale; Power_W: 63mW; TempCo: 100 ppm/C; Value_Code: 8k06; Value: 8.06k; EIA_Code: E96; SizeX_mm: 1; SizeY_mm: 0.5; SizeZ_mm: 0.6; Value2: 0.063W; AEC Qualified: Y; VDC_V: 50V; AEC Category: Q200; AEC Grade: 0; ComponentLink1URL: http://www.vishay.com/docs/20035/dcrcwe3.pdf; Supplier Part Number 2: 52K7286; Supplier 2: Newark; Supplier Part Number 3: 71-CRCW0402-8.06K-E3; Supplier 3: Mouser; RoHS: E; Value1: 1%; MountType: SMT; Supplier 1: Digi-Key; PackageReference: 0402; Tolerance_%: 1%; Res_ohm: 8.06k; SizeArea_mm2: 0.5; CompType: Resistor; PartNumber: CRCW04028K06FKED; ComponentLink1Description: Datasheet link; Supplier Part Number 1: 541-8.06KLCT-ND; Technology: Thick Film
R7 = CMP-0025960-3: RES, 10.5 k, 1%, 0.063 W, AEC-Q200 Grade 0, 0402; Manufacturer: Vishay-Dale; Power_W: 63mW; TempCo: 100 ppm/C; Value_Code: 10k5; Value: 10.5k; EIA_Code: E96; SizeX_mm: 1; SizeY_mm: 0.5; SizeZ_mm: 0.6; Value2: 0.063W; CompType: Resistor; AEC Qualified: Y; AEC Grade: 0; AEC Category: Q200; VDC_V: 50V; RoHS: E; Value1: 1%; MountType: SMT; Supplier 1: Digi-Key; PackageReference: 0402; Tolerance_%: 1%; Res_ohm: 10.5k; SizeArea_mm2: 0.5; PartNumber: CRCW040210K5FKED; ComponentLink1Description: Datasheet link; Supplier Part Number 1: 541-10.5KLCT-ND; Technology: Thick Film; ComponentLink1URL: http://www.vishay.com/docs/20035/dcrcwe3.pdf; Supplier 2: Newark; Supplier 3: Mouser; Supplier Part Number 2: 52K6597; Supplier Part Number 3: 71-CRCW0402-10.5K-E3
R8 = CMP-0026196-2: RES, 24.9 k, 1%, 0.063 W, AEC-Q200 Grade 0, 0402; Manufacturer: Vishay-Dale; Power_W: 63mW; TempCo: 100 ppm/C; Value_Code: 24k9; Value: 24.9k; EIA_Code: E96; SizeX_mm: 1; SizeY_mm: 0.5; SizeZ_mm: 0.6; Value2: 0.063W; AEC Qualified: Y; VDC_V: 50V; AEC Category: Q200; AEC Grade: 0; ComponentLink1URL: http://www.vishay.com/docs/20035/dcrcwe3.pdf; Supplier Part Number 2: 52K6876; Supplier 2: Newark; Supplier Part Number 3: 71-CRCW0402-24.9K-E3; Supplier 3: Mouser; RoHS: E; Value1: 1%; MountType: SMT; Supplier 1: Digi-Key; PackageReference: 0402; Tolerance_%: 1%; Res_ohm: 24.9k; SizeArea_mm2: 0.5; CompType: Resistor; PartNumber: CRCW040224K9FKED; ComponentLink1Description: Datasheet link; Supplier Part Number 1: 541-24.9KLCT-ND; Technology: Thick Film
R9 = CMP-0026438-2: RES, 51.1, 1%, 0.063 W, AEC-Q200 Grade 0, 0402; Manufacturer: Vishay-Dale; Power_W: 63mW; TempCo: 100 ppm/C; Value_Code: 51R1; Value: 51.1; EIA_Code: E96; SizeX_mm: 1; SizeY_mm: 0.5; SizeZ_mm: 0.6; Value2: 0.063W; AEC Qualified: Y; VDC_V: 50V; AEC Grade: 0; AEC Category: Q200; ComponentLink1URL: http://www.vishay.com/docs/20035/dcrcwe3.pdf; RoHS: E; Value1: 1%; MountType: SMT; Supplier 1: Digi-Key; PackageReference: 0402; Tolerance_%: 1%; Res_ohm: 51.1; SizeArea_mm2: 0.5; CompType: Resistor; PartNumber: CRCW040251R1FKED; ComponentLink1Description: Datasheet link; Supplier Part Number 1: 541-51.1LCT-ND; Technology: Thick Film; Supplier 2: Newark; Supplier 3: Mouser; Supplier Part Number 2: 52K7132; Supplier Part Number 3: 71-CRCW0402-51.1-E3
R10 = CMP-0026088-3: RES, 1.50 k, 1%, 0.063 W, AEC-Q200 Grade 0, 0402; Manufacturer: Vishay-Dale; Power_W: 63mW; TempCo: 100 ppm/C; Value_Code: 1k50; Value: 1.50k; EIA_Code: E96; Res_ohm: 1.5k; SizeX_mm: 1; SizeY_mm: 0.5; SizeZ_mm: 0.6; Value2: 0.063W; AEC Qualified: Y; VDC_V: 50V; AEC Category: Q200; AEC Grade: 0; ComponentLink1URL: http://www.vishay.com/docs/20035/dcrcwe3.pdf; Supplier Part Number 2: 52K6575; Supplier 2: Newark; Supplier Part Number 3: 71-CRCW0402-1.5K-E3; Supplier 3: Mouser; RoHS: E; Value1: 1%; MountType: SMT; Supplier 1: Digi-Key; PackageReference: 0402; Tolerance_%: 1%; SizeArea_mm2: 0.5; CompType: Resistor; PartNumber: CRCW04021K50FKED; ComponentLink1Description: Datasheet link; Supplier Part Number 1: 541-1.50KLCT-ND; Technology: Thick Film
R11 = CMP-0026170-2: RES, 21.0 k, 1%, 0.063 W, AEC-Q200 Grade 0, 0402; Manufacturer: Vishay-Dale; Power_W: 63mW; TempCo: 100 ppm/C; Value_Code: 21k0; Value: 21.0k; EIA_Code: E96; Res_ohm: 21k; SizeX_mm: 1; SizeY_mm: 0.5; SizeZ_mm: 0.6; Value2: 0.063W; AEC Qualified: Y; VDC_V: 50V; AEC Category: Q200; AEC Grade: 0; Supplier Part Number 2: 52K6830; Supplier 2: Newark; Supplier Part Number 3: 71-CRCW0402-21K-E3; Supplier 3: Mouser; RoHS: E; Value1: 1%; MountType: SMT; Supplier 1: Digi-Key; PackageReference: 0402; Tolerance_%: 1%; SizeArea_mm2: 0.5; CompType: Resistor; PartNumber: CRCW040221K0FKED; ComponentLink1Description: Datasheet link; Supplier Part Number 1: 541-21.0KLCT-ND; Technology: Thick Film; ComponentLink1URL: http://www.vishay.com/docs/20035/dcrcwe3.pdf
R13 = CMP-0022204-4: RES, 20.0 k, 1%, 0.1 W, AEC-Q200 Grade 0, 0603; Manufacturer: Vishay-Dale; Power_W: 100mW; TempCo: 100 ppm/C; Value_Code: 20k0; Value: 20.0k; EIA_Code: E96; Res_ohm: 20k; SizeX_mm: 1.6; SizeY_mm: 0.8; SizeZ_mm: 1; Value2: 0.1W; SizeArea_mm2: 1.28; CompType: Resistor; AEC Qualified: Y; VDC_V: 75V; AEC Category: Q200; AEC Grade: 0; Supplier Part Number 2: 52K8267; Supplier 2: Newark; Supplier Part Number 3: 71-CRCW0603-20K-E3; Supplier 3: Mouser; RoHS: E; Value1: 1%; MountType: SMT; Supplier 1: Digi-Key; PackageReference: 0603; Tolerance_%: 1%; PartNumber: CRCW060320K0FKEA; ComponentLink1Description: Datasheet link; Supplier Part Number 1: 541-20.0KHCT-ND; Technology: Thick Film; ComponentLink1URL: http://www.vishay.com/docs/20035/dcrcwe3.pdf
R14 = CMP-0026315-2: RES, 36.5 k, 1%, 0.063 W, AEC-Q200 Grade 0, 0402; Manufacturer: Vishay-Dale; Power_W: 63mW; TempCo: 100 ppm/C; Value_Code: 36k5; Value: 36.5k; EIA_Code: E96; SizeX_mm: 1; SizeY_mm: 0.5; SizeZ_mm: 0.6; Value2: 0.063W; AEC Qualified: Y; VDC_V: 50V; AEC Category: Q200; AEC Grade: 0; Supplier Part Number 2: 52K7007; Supplier 2: Newark; Supplier Part Number 3: 71-CRCW0402-36.5K-E3; Supplier 3: Mouser; RoHS: E; Value1: 1%; MountType: SMT; Supplier 1: Digi-Key; PackageReference: 0402; Tolerance_%: 1%; Res_ohm: 36.5k; SizeArea_mm2: 0.5; CompType: Resistor; PartNumber: CRCW040236K5FKED; ComponentLink1Description: Datasheet link; Supplier Part Number 1: 541-36.5KLCT-ND; Technology: Thick Film; ComponentLink1URL: http://www.vishay.com/docs/20035/dcrcwe3.pdf
TP1 = CMP-0078225-1: PC Test Point, SMT; Manufacturer: Keystone; PartNumber: 5017; Supplier Part Number 2: 05AC2856; Key: 5017; Supplier 3: Mouser; PackageReference: PC Test Point, SMT; CompType: Test Point; Supplier Part Number 1: 36-5017CT-ND; ComponentLink1Description: Datasheet Link; MountType: SMT; ComponentLink1URL: http://www.keyelco.com/product-pdf.cfm?p=1355; Supplier 1: Digi-Key; RoHS: Y; Supplier 2: Newark; Supplier Part Number 3: 534-5017
TP2-TP4 TP6 TP7 = CMP-0078225-1: PC Test Point, SMT; PartNumber: 5017; Manufacturer: Keystone; Supplier Part Number 2: 05AC2856; Key: 5017; Supplier 3: Mouser; PackageReference: PC Test Point, SMT; CompType: Test Point; Supplier Part Number 1: 36-5017CT-ND; ComponentLink1Description: Datasheet Link; MountType: SMT; ComponentLink1URL: http://www.keyelco.com/product-pdf.cfm?p=1355; Supplier 1: Digi-Key; RoHS: Y; Supplier 2: Newark; Supplier Part Number 3: 534-5017
U1 = CMP-0081848-1: 5.5-V to 100-V Synchronous Buck Controller With Wide Duty Cycle Range, RGY0020B (VQFN-20); Alternate PartNumber: LM5146QRGYTQ1; Alternate Manufacturer: Texas Instruments; SizeAreaWB_mm2: 24.75; SizeZ_mm: 1; SizeX_mm: 3.5; SizeY_mm: 4.5; SizeArea_mm2: 15.75; CompType: IC; AEC Qualified: Y; AEC Category: Q200; ComponentLink1URL: http://www.ti.com/lit/ds/symlink/lm5146-q1.pdf; PackageDescription: VQFN-20; MountType: SMT; ComponentLink2URL: http://www.ti.com/product/lm5146-q1; ComponentLink3Description: Online Datasheet; ComponentLink2Description: Product Folder; Manufacturer: Texas Instruments; ComponentLink3URL: http://www.ti.com/product/lm5146-q1/datasheet; PackageReference: RGY0020B; PartNumber: LM5146QRGYRQ1; ComponentLink1Description: Datasheet Link